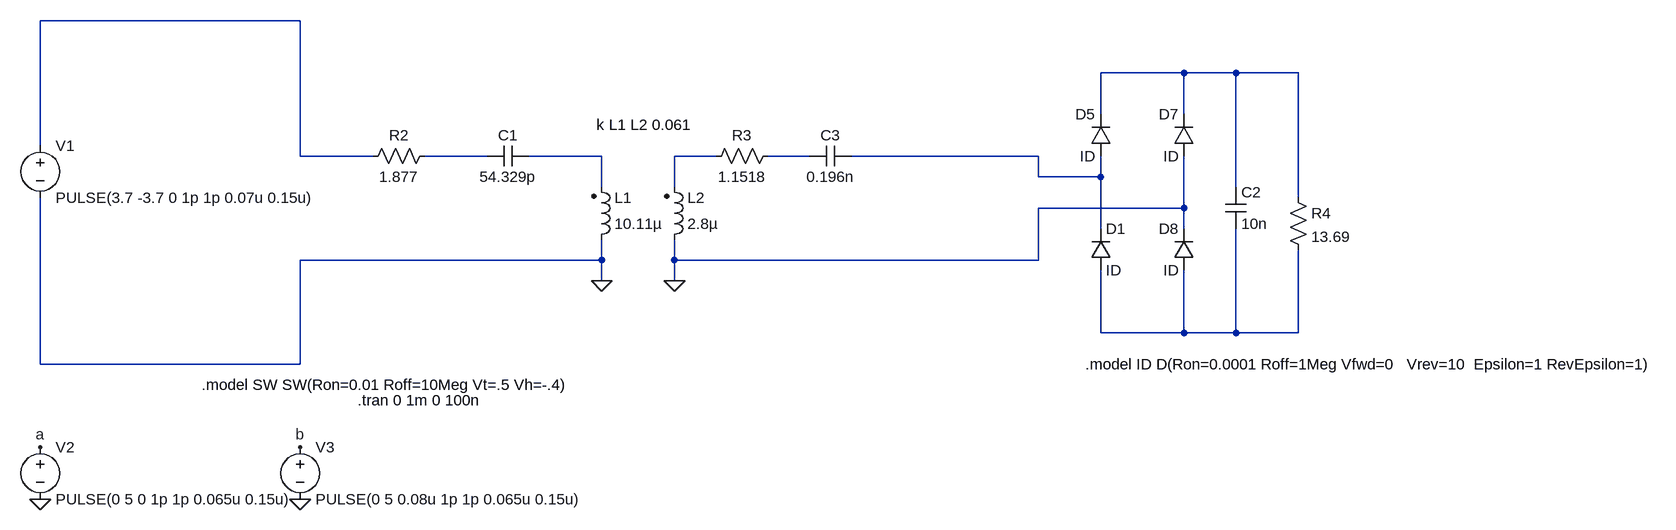
[diagram p0: schematic WPT_GaN3.asc]
WPT_GaN3.asc, the LTspice schematic file:
Version 4
SHEET 1 2368 796
WIRE -80 -96 -480 -96
WIRE 1280 -16 1152 -16
WIRE 1360 -16 1280 -16
WIRE 1456 -16 1360 -16
WIRE 1152 48 1152 -16
WIRE 1280 48 1280 -16
WIRE -480 96 -480 -96
WIRE -80 112 -80 -96
WIRE 32 112 -80 112
WIRE 208 112 112 112
WIRE 384 112 272 112
WIRE 560 112 496 112
WIRE 704 112 640 112
WIRE 1056 112 768 112
WIRE 1056 144 1056 112
WIRE 1152 144 1152 112
WIRE 1152 144 1056 144
WIRE 384 160 384 112
WIRE 496 160 496 112
WIRE 1360 160 1360 -16
WIRE 1456 176 1456 -16
WIRE 1280 192 1280 112
WIRE 1280 192 1056 192
WIRE 1152 224 1152 144
WIRE 1280 224 1280 192
WIRE 384 272 384 240
WIRE 384 272 -80 272
WIRE 496 272 496 240
WIRE 1056 272 1056 192
WIRE 1056 272 496 272
WIRE 384 304 384 272
WIRE 496 304 496 272
WIRE 1152 384 1152 288
WIRE 1280 384 1280 288
WIRE 1280 384 1152 384
WIRE 1360 384 1360 224
WIRE 1360 384 1280 384
WIRE 1456 384 1456 256
WIRE 1456 384 1360 384
WIRE -480 432 -480 176
WIRE -80 432 -80 272
WIRE -80 432 -480 432
FLAG -480 560 a
FLAG -80 560 b
FLAG 384 304 0
FLAG 496 304 0
FLAG -480 640 0
FLAG -80 640 0
SYMBOL voltage -480 80 R0
WINDOW 123 0 0 Left 0
WINDOW 39 0 0 Left 0
SYMATTR InstName V1
SYMATTR Value PULSE(3.7 -3.7 0 1p 1p 0.07u 0.15u)
SYMBOL voltage -480 544 R0
WINDOW 123 0 0 Left 0
WINDOW 39 0 0 Left 0
SYMATTR InstName V2
SYMATTR Value PULSE(0 5 0 1p 1p 0.065u 0.15u)
SYMBOL voltage -80 544 R0
WINDOW 123 0 0 Left 0
WINDOW 39 0 0 Left 0
SYMATTR InstName V3
SYMATTR Value PULSE(0 5 0.08u 1p 1p 0.065u 0.15u)
SYMBOL cap 272 96 R90
WINDOW 0 0 32 VBottom 2
WINDOW 3 32 32 VTop 2
SYMATTR InstName C1
SYMATTR Value 54.329p
SYMBOL ind2 368 256 M180
WINDOW 0 36 80 Left 2
WINDOW 3 36 40 Left 2
SYMATTR InstName L1
SYMATTR Value 10.11µ
SYMATTR Type ind
SYMBOL ind2 480 256 M180
WINDOW 0 36 80 Left 2
WINDOW 3 36 40 Left 2
SYMATTR InstName L2
SYMATTR Value 2.8µ
SYMATTR Type ind
SYMBOL res 128 96 R90
WINDOW 0 0 56 VBottom 2
WINDOW 3 32 56 VTop 2
SYMATTR InstName R2
SYMATTR Value 1.877
SYMBOL res 656 96 R90
WINDOW 0 0 56 VBottom 2
WINDOW 3 32 56 VTop 2
SYMATTR InstName R3
SYMATTR Value 1.1518
SYMBOL cap 768 96 R90
WINDOW 0 0 32 VBottom 2
WINDOW 3 32 32 VTop 2
SYMATTR InstName C3
SYMATTR Value 0.196n
SYMBOL res 1440 160 R0
SYMATTR InstName R4
SYMATTR Value 13.69
SYMBOL diode 1168 112 R180
WINDOW 0 24 64 Left 2
WINDOW 3 24 0 Left 2
SYMATTR InstName D5
SYMATTR Value ID
SYMBOL diode 1296 112 R180
WINDOW 0 24 64 Left 2
WINDOW 3 24 0 Left 2
SYMATTR InstName D7
SYMATTR Value ID
SYMBOL diode 1296 288 R180
WINDOW 0 24 64 Left 2
WINDOW 3 24 0 Left 2
SYMATTR InstName D8
SYMATTR Value ID
SYMBOL diode 1136 288 M180
WINDOW 0 24 64 Left 2
WINDOW 3 24 0 Left 2
SYMATTR InstName D1
SYMATTR Value ID
SYMBOL cap 1344 160 R0
SYMATTR InstName C2
SYMATTR Value 10n
TEXT 376 64 Left 2 !k L1 L2 0.061
TEXT 8 488 Left 2 !.tran 0 1m 0 100n
TEXT -232 464 Left 2 !.model SW SW(Ron=0.01 Roff=10Meg Vt=.5 Vh=-.4)
TEXT 1128 432 Left 2 !.model ID D(Ron=0.0001 Roff=1Meg Vfwd=0   Vrev=10  Epsilon=1 RevEpsilon=1)

The netlist it stands for:
* WPT_GaN3.asc
V1 N001 0 PULSE(3.7 -3.7 0 1p 1p 0.07u 0.15u)
V2 a 0 PULSE(0 5 0 1p 1p 0.065u 0.15u)
V3 b 0 PULSE(0 5 0.08u 1p 1p 0.065u 0.15u)
C1 N004 N003 54.329p
L1 0 N004 10.11µ
L2 0 N005 2.8µ
R2 N003 N001 1.877
R3 N006 N005 1.1518
C3 N007 N006 0.196n
R4 N002 N008 13.69
D5 N007 N002 ID
D7 0 N002 ID
D8 N008 0 ID
D1 N008 N007 ID
C2 N002 N008 10n
.model D D
.lib standard.dio
k L1 L2 0.061
.tran 0 1m 0 100n
.model SW SW(Ron=0.01 Roff=10Meg Vt=.5 Vh=-.4)
.model ID D(Ron=0.0001 Roff=1Meg Vfwd=0   Vrev=10  Epsilon=1 RevEpsilon=1)
.backanno
.end